# EAGLE design x0x - midi daughter schematic (EAGLE 6.5.0)
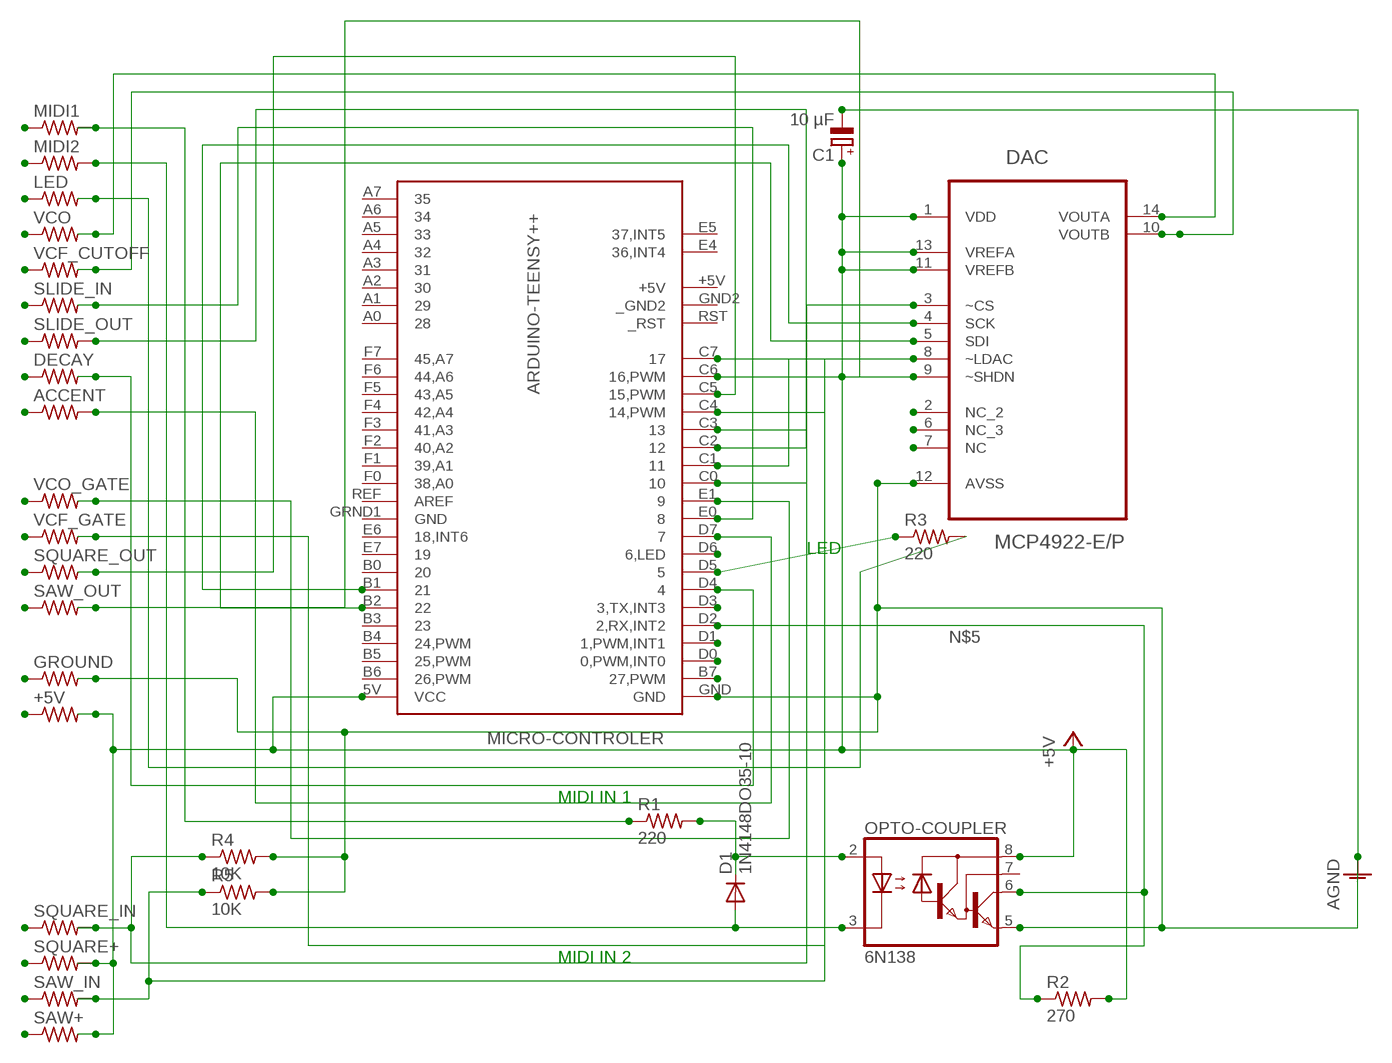
[diagram p0: schematic, sheet 1]

## Parts
+5V  R-US_0207/10  [0207/10]
ACCENT  R-US_0207/10  [0207/10]
C1  10 µF  CPOL-EUE1.8-4  [E1,8-4]
D1  1N4148DO35-10  [DO35-10]
DAC  MCP4922-E/P  [DIP254P762X533-14]
DECAY  R-US_0207/10  [0207/10]
GROUND  R-US_0207/10  [0207/10]
LED  R-US_0207/10  [0207/10]
MICRO-CONTROLER  ARDUINO-TEENSY++  [TEENSY++]
MIDI1  R-US_0207/10  [0207/10]
MIDI2  R-US_0207/10  [0207/10]
OPTO-COUPLER  6N138  [DIL08]
R1  220  R-US_0204/7  [0204/7]
R2  270  R-US_0204/7  [0204/7]
R3  220  R-US_0204/7  [0204/7]
R4  10K  R-US_0207/10  [0207/10]
R5  10K  R-US_0207/10  [0207/10]
SAW+  R-US_0207/10  [0207/10]
SAW_IN  R-US_0207/10  [0207/10]
SAW_OUT  R-US_0207/10  [0207/10]
SLIDE_IN  R-US_0207/10  [0207/10]
SLIDE_OUT  R-US_0207/10  [0207/10]
SQUARE+  R-US_0207/10  [0207/10]
SQUARE_IN  R-US_0207/10  [0207/10]
SQUARE_OUT  R-US_0207/10  [0207/10]
VCF_CUTOFF  R-US_0207/10  [0207/10]
VCF_GATE  R-US_0207/10  [0207/10]
VCO  R-US_0207/10  [0207/10]
VCO_GATE  R-US_0207/10  [0207/10]

## Nets
+5V: +5V.2 C1.+ DAC.1(VDD) DAC.9(~SHDN) DAC.11(VREFB) DAC.13(VREFA) MICRO-CONTROLER.5V(VCC) OPTO-COUPLER.8(VCC) R2.2 SAW+.2 SQUARE+.2
AGND: C1.- DAC.12(AVSS) GROUND.2 MICRO-CONTROLER.GND OPTO-COUPLER.5(GND) R4.2 R5.2
N$1: DAC.4(SCK) MICRO-CONTROLER.B1
N$2: DAC.5(SDI) MICRO-CONTROLER.B2
N$3: DAC.3(~CS) MICRO-CONTROLER.C0
N$4: D1.A MIDI2.2 OPTO-COUPLER.3(C)
N$5: MICRO-CONTROLER.D2(2,RX,INT2) OPTO-COUPLER.6(VO) R2.1
N$6: D1.C OPTO-COUPLER.2(A) R1.2
N$7: MICRO-CONTROLER.D5 R3.1
N$8: MIDI1.2 R1.1
N$9: MICRO-CONTROLER.C2 SLIDE_OUT.2
N$10: LED.2 R3.2
N$11: DAC.14(VOUTA) VCO.2
N$12: DAC.10(VOUTB) VCF_CUTOFF.2
N$13: MICRO-CONTROLER.E0 SLIDE_IN.2
N$14: DECAY.2 MICRO-CONTROLER.D4
N$15: ACCENT.2 MICRO-CONTROLER.D7
N$16: MICRO-CONTROLER.E1 VCO_GATE.2
N$17: MICRO-CONTROLER.C7 VCF_GATE.2
N$18: MICRO-CONTROLER.C3 R4.1 SQUARE_IN.2
N$19: MICRO-CONTROLER.C4(14,PWM) R5.1 SAW_IN.2
N$20: SAW+.1
N$21: SAW_IN.1
N$22: SQUARE+.1
N$23: MICRO-CONTROLER.C5(15,PWM) SQUARE_OUT.2
N$24: MICRO-CONTROLER.C6(16,PWM) SAW_OUT.2
N$25: SQUARE_IN.1
N$26: +5V.1
N$27: GROUND.1
N$28: SAW_OUT.1
N$29: SQUARE_OUT.1
N$30: VCF_GATE.1
N$31: VCO_GATE.1
N$32: ACCENT.1
N$33: DECAY.1
N$34: SLIDE_OUT.1
N$35: SLIDE_IN.1
N$36: VCF_CUTOFF.1
N$37: VCO.1
N$38: LED.1
N$39: MIDI2.1
N$40: MIDI1.1
N$41: DAC.8(~LDAC) MICRO-CONTROLER.C1
N$42: DAC.2(NC_2)
N$43: DAC.6(NC_3)
N$44: DAC.7(NC)
N$46: MICRO-CONTROLER.D6(6,LED)
N$47: MICRO-CONTROLER.D3(3,TX,INT3)
N$48: MICRO-CONTROLER.D1(1,PWM,INT1)
N$49: MICRO-CONTROLER.D0(0,PWM,INT0)
N$50: MICRO-CONTROLER.B7(27,PWM)
Unconnected: MICRO-CONTROLER.A0 MICRO-CONTROLER.A1 MICRO-CONTROLER.A2 MICRO-CONTROLER.A3 MICRO-CONTROLER.A4 MICRO-CONTROLER.A5 MICRO-CONTROLER.A6 MICRO-CONTROLER.A7 MICRO-CONTROLER.B0 MICRO-CONTROLER.B3 MICRO-CONTROLER.B4(24,PWM) MICRO-CONTROLER.B5(25,PWM) MICRO-CONTROLER.B6(26,PWM) MICRO-CONTROLER.E4(36,INT4) MICRO-CONTROLER.E5(37,INT5) MICRO-CONTROLER.E6(18,INT6) MICRO-CONTROLER.E7 MICRO-CONTROLER.F0(38,A0) MICRO-CONTROLER.F1(39,A1) MICRO-CONTROLER.F2(40,A2) MICRO-CONTROLER.F3(41,A3) MICRO-CONTROLER.F4(42,A4) MICRO-CONTROLER.F5(43,A5) MICRO-CONTROLER.F6(44,A6) MICRO-CONTROLER.F7(45,A7) MICRO-CONTROLER.REF(AREF) MICRO-CONTROLER.RST(_RST) OPTO-COUPLER.7(VB)

## Notes on the sheet
- LED
- MIDI IN 1
- MIDI IN 2

## Power pins joined to a net without a drawn wire
+5V: MICRO-CONTROLER.+5V
_GND2: MICRO-CONTROLER.GND2(_GND2)
GND: MICRO-CONTROLER.GRND1(GND)

## Library data of the parts
+5V ACCENT DECAY GROUND LED MIDI1 MIDI2 R3-R5 SAW+ SAW_IN SAW_OUT SLIDE_IN SLIDE_OUT SQUARE+ SQUARE_IN SQUARE_OUT VCF_CUTOFF VCF_GATE VCO VCO_GATE = rcl:R-US_: RESISTOR, American symbol
C1 = rcl:CPOL-EU: POLARIZED CAPACITOR, European symbol
D1 = diode:1N4148: DIODE high speed (Philips)
DAC = Microchip_By_element14_Batch_1:MCP4922-E/P: 12-Bit DAC; MPN: MCP4922-E/P; OC_FARNELL: 1292244; OC_NEWARK: 61K2950; PACKAGE: DIP-14; SUPPLIER: Microchip
MICRO-CONTROLER = teensypp:ARDUINO-TEENSY++
OPTO-COUPLER = optocoupler:6N138: MOTOROLA OPTO COUPLER; MF: VISHAY/TELEFUNKEN; MPN: 6N138; OC_FARNELL: 9860150; OC_NEWARK: 35K5294
R1 R2 = resistor:R-US_: RESISTOR, American symbol

## Net classes
0 default: clearance 0.205 mm

## Board
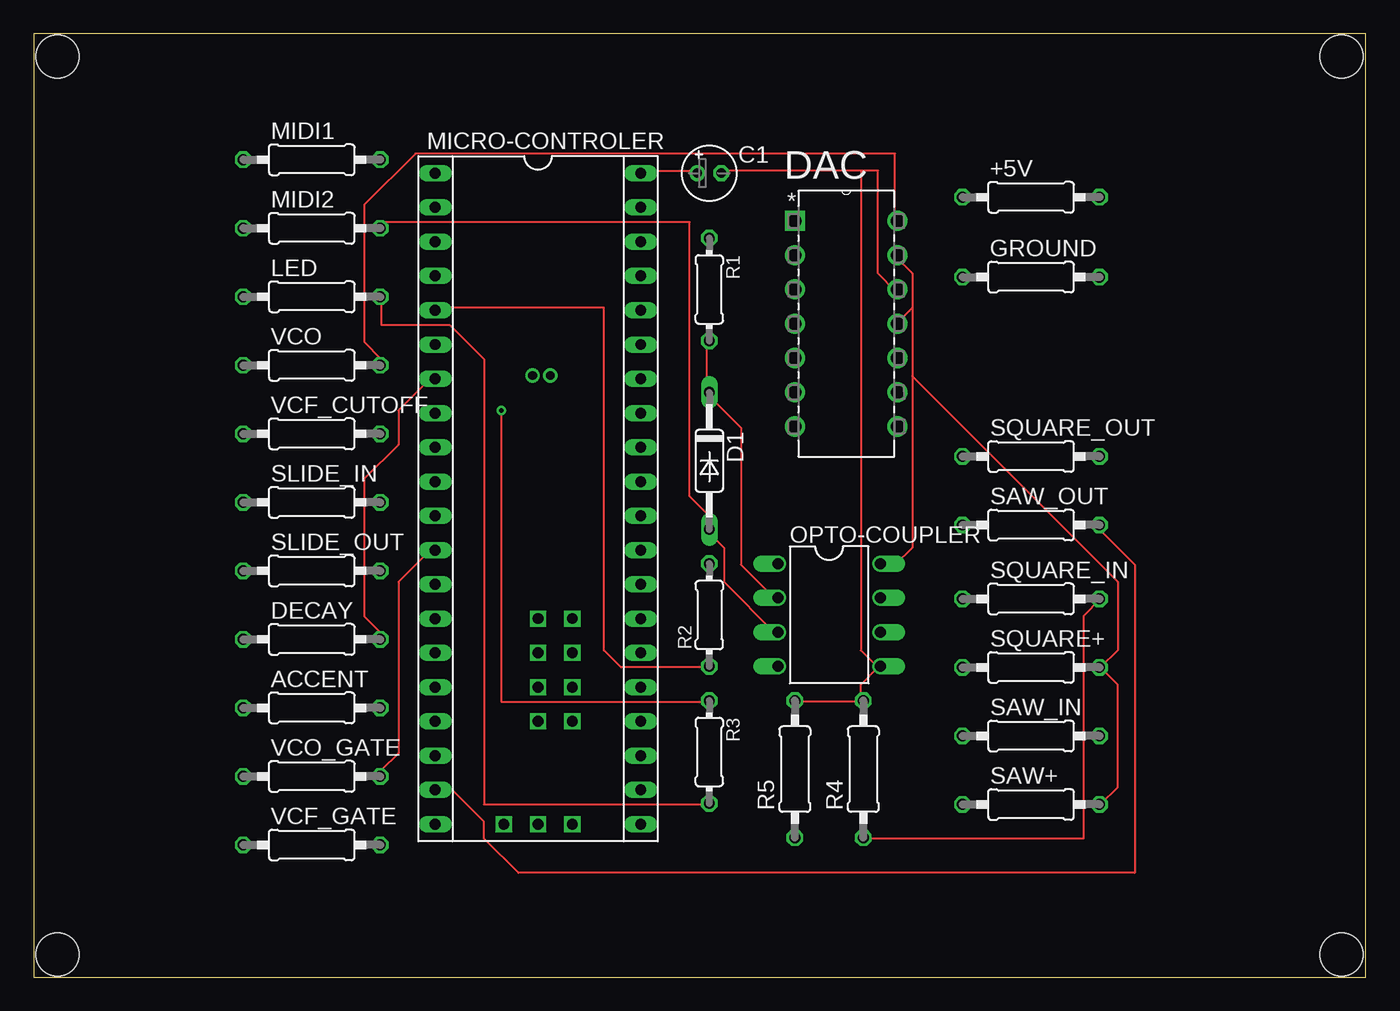
[diagram p1: board, top side]
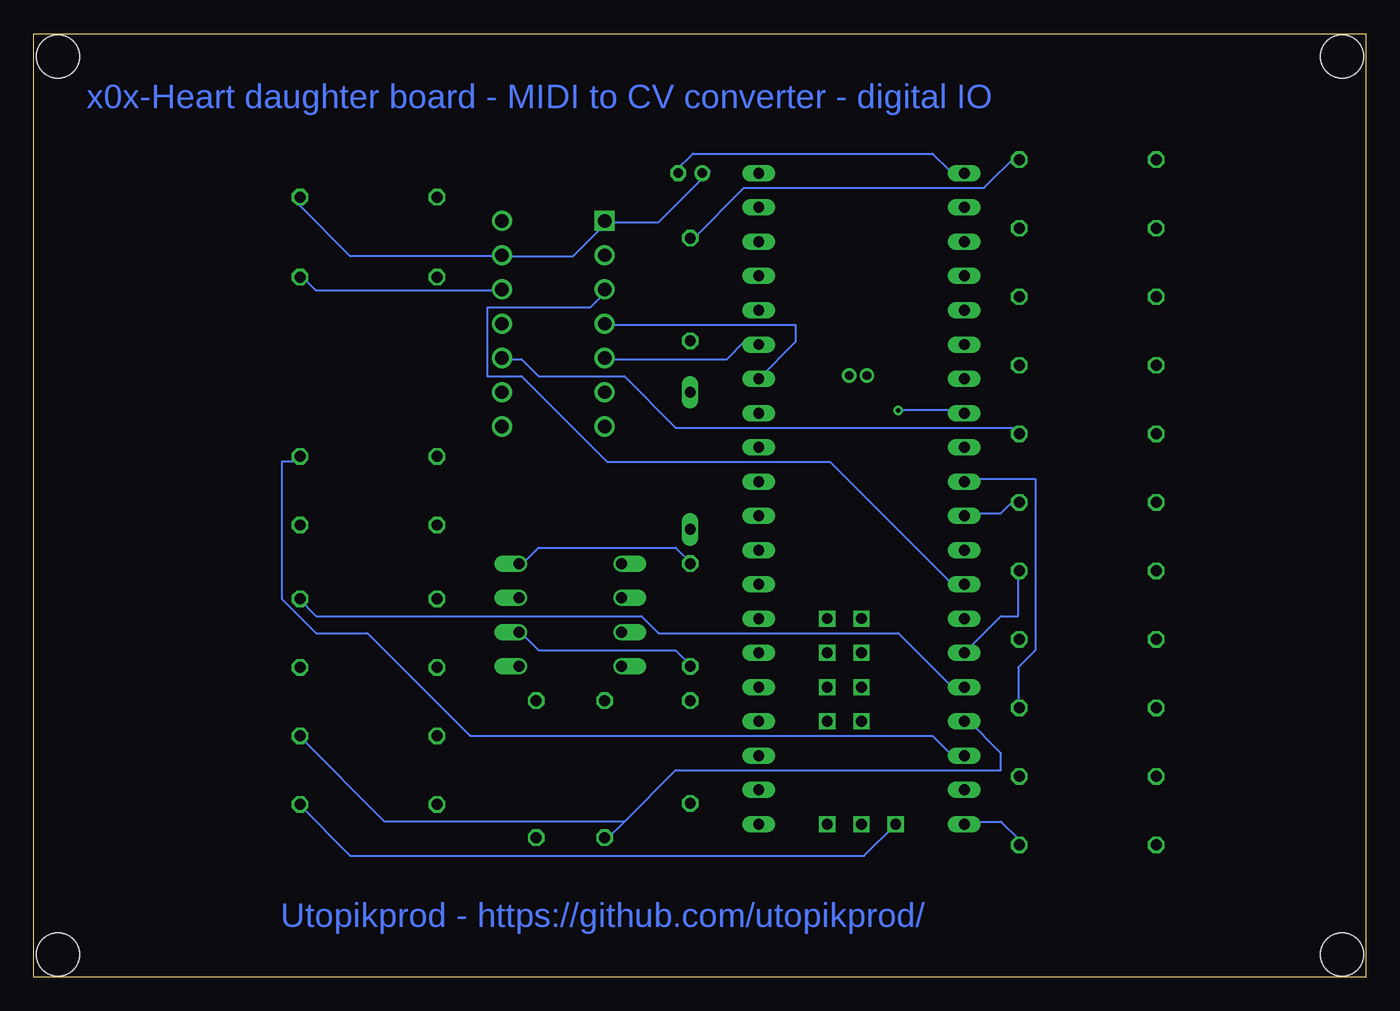
[diagram p2: board, bottom side, seen from below]

Size 98.79 x 69.95 mm. Coordinates in mm from the lower left corner, seen from the top.
Outline: 0,0 98.79,0 98.79,69.95 0,69.95 0,0
Copper layers (1*16): Top 0.0356mm / dielectric 1.5011mm / Bottom 0.0356mm
Design rules "default": minimum track width 6mil, minimum drill 13mil, track to track 6mil, track to pad 6mil, pad to pad 6mil, via to via 6mil, smd to smd 6mil, copper to edge 15mil, drill to drill 6mil, minimum pad ring 7mil, minimum via ring 7mil, stop-mask expansion 3mil, vias tented up to drill 0mil, thermal gap 10mil
Holes 3.2 mm at 1.78,68.27 96.98,68.27 1.78,1.67 96.98,1.67

### Footprints (pad centres in the part's own frame; a part is rotated, then mirrored left to right if it is on the bottom)
0207/10 = drill 0.813 octagon: 1 -5.08,0; 2 5.08,0
E1,8-4 = drill 0.711 pad 1.168: + -0.889,0 | drill 0.711 pad 1.168 octagon: - 0.889,0
DO35-10 = drill 0.813 long: A 5.08,0; C -5.08,0
DIP254P762X533-14 = drill 0.991 square: 1 -7.62,15.24 | drill 0.991: 2 -7.62,12.7; 3 -7.62,10.16; 4 -7.62,7.62; 5 -7.62,5.08; 6 -7.62,2.54; 7 -7.62,0; 8 0,0; 9 0,2.54; 10 0,5.08; 11 0,7.62; 12 0,10.16; 13 0,12.7; 14 0,15.24
TEENSY++ = drill 0.8 square: 5V 24.13,-2.54; A0 8.89,0; A1 11.43,0; A2 13.97,0; A3 16.51,0; A4 8.89,2.54; A5 11.43,2.54; A6 13.97,2.54; A7 16.51,2.54; GND2 24.13,0; RST 24.13,2.54 | drill 0.813 long: +5V -24.13,7.62; B0 -6.35,7.62; B1 -8.89,7.62; B2 -11.43,7.62; B3 -13.97,7.62; B4 -16.51,7.62; B5 -19.05,7.62; B6 -21.59,7.62; B7 -21.59,-7.62; C0 6.35,-7.62; C1 8.89,-7.62; C2 11.43,-7.62; C3 13.97,-7.62; C4 16.51,-7.62; C5 19.05,-7.62; C6 21.59,-7.62; C7 24.13,-7.62; D0 -19.05,-7.62; D1 -16.51,-7.62; D2 -13.97,-7.62; D3 -11.43,-7.62; D4 -8.89,-7.62; D5 -6.35,-7.62; D6 -3.81,-7.62; D7 -1.27,-7.62; E0 1.27,-7.62; E1 3.81,-7.62; E6 -1.27,7.62; E7 -3.81,7.62; F0 6.35,7.62; F1 8.89,7.62; F2 11.43,7.62; F3 13.97,7.62; F4 16.51,7.62; F5 19.05,7.62; F6 21.59,7.62; F7 24.13,7.62; GND -24.13,-7.62; GRND1 1.27,7.62; REF 3.81,7.62 | drill 0.635 pad 1.067: E4 -9.144,0.914; E5 -9.144,-0.406
DIL08 = drill 0.813 offset: 1 -3.81,-3.81; 2 -1.27,-3.81; 3 1.27,-3.81; 4 3.81,-3.81; 5 3.81,3.81; 6 1.27,3.81; 7 -1.27,3.81; 8 -3.81,3.81
0204/7 = drill 0.813 octagon: 1 -3.81,0; 2 3.81,0

### Placement (x,y rotation side)
+5V  73.96,57.83 0 top
ACCENT  20.62,19.97 0 top
C1  50.1,59.61 0 top
D1  50.1,38.29 270 top
DAC  64.07,40.83 0 top
DECAY  20.62,25.05 0 top
GROUND  73.96,51.91 0 top
LED  20.62,50.45 0 top
MICRO-CONTROLER  37.4,35.48 270 top
MIDI1  20.62,60.61 0 top
MIDI2  20.62,55.53 0 top
OPTO-COUPLER  58.99,26.86 270 top
R1  50.1,50.99 270 top
R2  50.1,26.86 90 top
R3  50.1,16.7 270 top
R4  61.53,15.43 90 top
R5  56.45,15.43 90 top
SAW+  73.96,12.81 0 top
SAW_IN  73.96,17.89 0 top
SAW_OUT  73.96,33.53 0 top
SLIDE_IN  20.62,35.21 0 top
SLIDE_OUT  20.62,30.13 0 top
SQUARE+  73.96,22.97 0 top
SQUARE_IN  73.96,28.05 0 top
SQUARE_OUT  73.96,38.61 0 top
VCF_CUTOFF  20.62,40.29 0 top
VCF_GATE  20.62,9.81 0 top
VCO  20.62,45.37 0 top
VCO_GATE  20.62,14.89 0 top

### Tracks (layer width: path | path; a pad name or v marks a point on that pad's centre or on a via)
+5V
  Top 0.152: 79.12,22.97 80.39,21.7 80.39,14.08 79.12,12.81 SAW+.2 | C1.+ 48.64,59.8 46.1,59.8 MICRO-CONTROLER.+5V | 65.15,49.64 63.88,48.37 DAC.11 | 65.15,49.64 65.15,52.18 63.88,53.45 DAC.13 | 65.15,49.64 65.15,44.56 | 65.15,44.56 65.15,31.86 63.88,30.59 OPTO-COUPLER.8 | 79.12,22.97 80.39,24.24 80.39,29.32 65.15,44.56 | 79.12,22.97 SQUARE+.2
  Bottom 0.152: 34.67,11.54 MICRO-CONTROLER.5V 37.21,9 75.31,9 79.12,12.81 SAW+.2 | R2.2 49.91,30.59 51.18,31.86 61.34,31.86 62.61,30.59 OPTO-COUPLER.8 | 63.88,53.45 75.31,53.45 79.12,57.26 +5V.2 | 56.26,55.99 58.8,53.45 63.88,53.45 | 63.88,53.45 DAC.13 | 56.26,55.99 52.45,55.99 48.64,59.8 C1.+ | 56.26,55.99 DAC.1
AGND
  Top 0.152: 61.34,20.43 56.26,20.43 R5.2 | 62.61,22.97 61.34,21.7 61.34,20.43 | 61.34,20.43 R4.2 | 61.34,59.8 62.61,59.8 62.61,52.18 63.88,50.91 DAC.12 | 61.34,59.8 51.18,59.8 C1.- | 62.61,22.97 61.34,24.24 61.34,59.8 | 62.61,22.97 OPTO-COUPLER.5
  Bottom 0.152: GROUND.2 79.12,52.18 77.85,50.91 63.88,50.91 DAC.12 | MICRO-CONTROLER.GND 30.86,59.8 32.13,61.07 49.91,61.07 51.18,59.8 C1.-
N$1
  Bottom 0.152: MICRO-CONTROLER.B1 42.29,47.1 42.29,48.37 56.26,48.37 DAC.4
N$2
  Bottom 0.152: MICRO-CONTROLER.B2 46.1,47.1 47.37,45.83 56.26,45.83 DAC.5
N$3
  Bottom 0.152: MICRO-CONTROLER.C0 30.86,29.32 39.75,38.21 56.26,38.21 62.61,44.56 65.15,44.56 65.15,49.64 57.53,49.64 56.26,50.91 DAC.3
N$4
  Top 0.152: MIDI2.2 25.78,55.99 48.64,55.99 48.64,35.67 49.91,34.4 D1.A 49.91,33.13 51.18,31.86 51.18,29.32 54.99,25.51 OPTO-COUPLER.3
N$5
  Top 0.152: MICRO-CONTROLER.D2 30.86,49.64 42.29,49.64 42.29,24.24 43.56,22.97 49.91,22.97 R2.1
  Bottom 0.152: R2.1 49.91,22.97 51.18,24.24 61.34,24.24 62.61,25.51 OPTO-COUPLER.6
N$6
  Top 0.152: R1.2 49.91,47.1 49.91,44.56 D1.C 49.91,43.29 52.45,40.75 52.45,30.59 54.99,28.05 OPTO-COUPLER.2
N$7  (via drill 0.33)
  Top 0.152: v34.67,42.02 34.67,20.43 49.91,20.43 R3.1
  Bottom 0.152: v34.67,42.02 30.86,42.02 MICRO-CONTROLER.D5
N$8
  Bottom 0.152: MIDI1.2 25.78,61.07 28.32,58.53 46.1,58.53 49.91,54.72 R1.1
N$9
  Bottom 0.152: MICRO-CONTROLER.C2 27.05,26.78 25.78,26.78 25.78,30.59 SLIDE_OUT.2
N$10
  Top 0.152: R3.2 49.91,12.81 33.4,12.81 33.4,45.83 30.86,48.37 25.78,48.37 25.78,50.91 LED.2
N$11
  Top 0.152: VCO.2 25.78,45.83 24.51,47.1 24.51,57.26 28.32,61.07 63.88,61.07 63.88,55.99 DAC.14
N$12
  Bottom 0.152: VCF_CUTOFF.2 25.78,40.75 51.18,40.75 54.99,44.56 61.34,44.56 62.61,45.83 63.88,45.83 DAC.10
N$13
  Bottom 0.152: SLIDE_IN.2 25.78,35.67 27.05,34.4 29.59,34.4 MICRO-CONTROLER.E0
N$14
  Top 0.152: DECAY.2 25.78,25.51 24.51,26.78 24.51,36.94 27.05,39.48 27.05,42.02 29.59,44.56 MICRO-CONTROLER.D4
N$15
  Bottom 0.152: ACCENT.2 25.78,20.43 25.78,22.97 24.51,24.24 24.51,36.94 29.59,36.94 MICRO-CONTROLER.D7
N$16
  Top 0.152: VCO_GATE.2 25.78,15.35 27.05,16.62 27.05,29.32 29.59,31.86 MICRO-CONTROLER.E1
N$17
  Bottom 0.152: VCF_GATE.2 25.78,10.27 27.05,11.54 29.59,11.54 MICRO-CONTROLER.C7
N$18
  Top 0.152: R4.1 61.34,10.27 77.85,10.27 77.85,26.78 79.12,28.05 SQUARE_IN.2
  Bottom 0.152: MICRO-CONTROLER.C3 30.86,21.7 34.67,25.51 52.45,25.51 53.72,26.78 77.85,26.78 79.12,28.05 SQUARE_IN.2
N$19
  Bottom 0.152: 54.99,11.54 56.26,10.27 R5.1 | 54.99,11.54 51.18,15.35 27.05,15.35 27.05,16.62 29.59,19.16 MICRO-CONTROLER.C4 | 54.99,11.54 72.77,11.54 79.12,17.89 SAW_IN.2
N$23
  Bottom 0.152: MICRO-CONTROLER.C5 30.86,16.62 32.13,17.89 66.42,17.89 74.04,25.51 77.85,25.51 80.39,28.05 80.39,38.21 79.12,38.21 SQUARE_OUT.2
N$24
  Top 0.152: MICRO-CONTROLER.C6 30.86,14.08 33.4,11.54 33.4,10.27 35.94,7.73 81.66,7.73 81.66,30.59 79.12,33.13 SAW_OUT.2

### Text on the board
Bottom: x0x-Heart daughter board - MIDI to CV converter - digital IO | Utopikprod - https://github.com/utopikprod/